# Altium project PCB_Project.PrjPcb
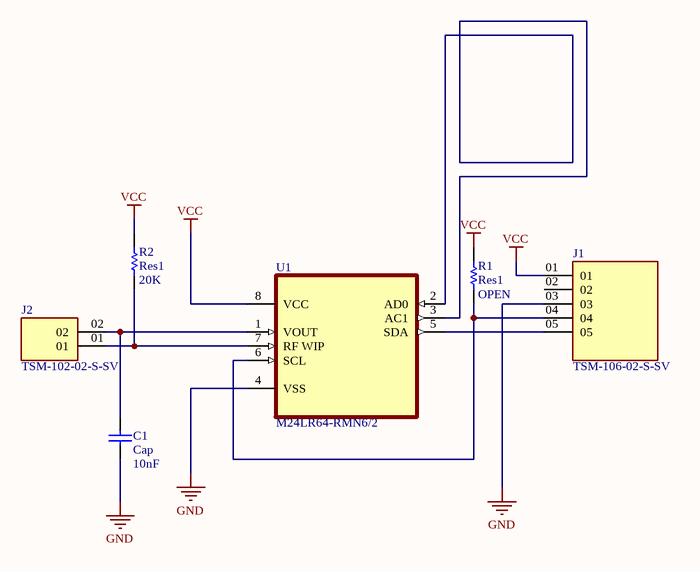
[diagram p0: Sheet1.SchDoc]
1 sheet, 6 parts. Net scope: global (net labels, ports and power ports of the same name join across sheets).

## Sheet Sheet1.SchDoc
size A4

### Parts
C1  Cap  value 10nF  [0402]
J1  TSM-106-02-S-SV  [SAMTEC_TSM-106-02-T-SH]
J2  TSM-102-02-S-SV  [SAMTEC_TSM-102-02-S-SV]
R1  Res1  value OPEN  [AXIAL-0.3]
R2  Res1  value 20K  [AXIAL-0.3]
U1  M24LR64-RMN6/2  [SOIC127P600X175-8N]

### Nets
GND: C1.1 J1.03 U1.4(VSS)
VCC: J1.01 R1.2 R2.2 U1.8(VCC)
NetC1_2: C1.2 J2.02 U1.1(VOUT)
NetJ1_04: J1.04 R1.1 U1.6(SCL)
NetJ1_05: J1.05 U1.5(SDA)
NetJ2_01: J2.01 R2.1 U1.7(RF_WIP)
NetU1_2: U1.2(AD0) U1.3(AC1)

Not connected (* = marked no-connect by the designer): J1 02

### Library data of the parts
C1 = Cap: Capacitor; Published: 8-Jun-2000; LatestRevisionDate: 17-Jul-2002; LatestRevisionNote: Re-released for DXP Platform.; PackageReference: RAD-0.3; Publisher: Altium Limited; PackageDescription: Radial Cap, Thru-Hole; 2 Leads; 0.3 in Pin Spacing
J1 = TSM-106-02-T-SH: MF: Samtec; Price: None; Package: None; Value: *; Availability: Unavailable; MP: TSM-106-02-T-SH
J2 = TSM-102-02-S-SV: Conn Unshrouded Header HDR 2 POS 2.54mm Solder ST SMD T/R; MF: Samtec Inc.; MP: TSM-102-02-S-SV-P-TR; Check_prices: https://www.snapeda.com/parts/TSM-102-02-S-SV-P-TR/Samtec%20Inc./view-part/3255768/?ref=eda; Value: *; SnapEDA_Link: https://www.snapeda.com/parts/TSM-102-02-S-SV-P-TR/Samtec%20Inc./view-part/3255768/?ref=snap; Price: None; Availability: Unavailable; Package: None; Purchase-URL: https://pricing.snapeda.com/search/part/TSM-102-02-S-SV-P-TR/?ref=eda
R1 R2 = Res1: Resistor; Published: 8-Jun-2000; LatestRevisionDate: 17-Jul-2002; LatestRevisionNote: Re-released for DXP Platform.; PackageReference: AXIAL-0.3; Publisher: Altium Limited; PackageDescription: Axial Device, Thru-Hole; 2 Leads; 0.3 in Pin Spacing
U1 = M24LR64-RMN6/2: 64 Kbit EEPROM; MP: M24LR64-RMN6-2; Package: None; Price: None; Value: *; Availability: Unavailable